# Altium schematic sheet IOS.SchDoc
size A3; DocumentNumber: 3; SheetNumber: 3; SheetTotal: 15
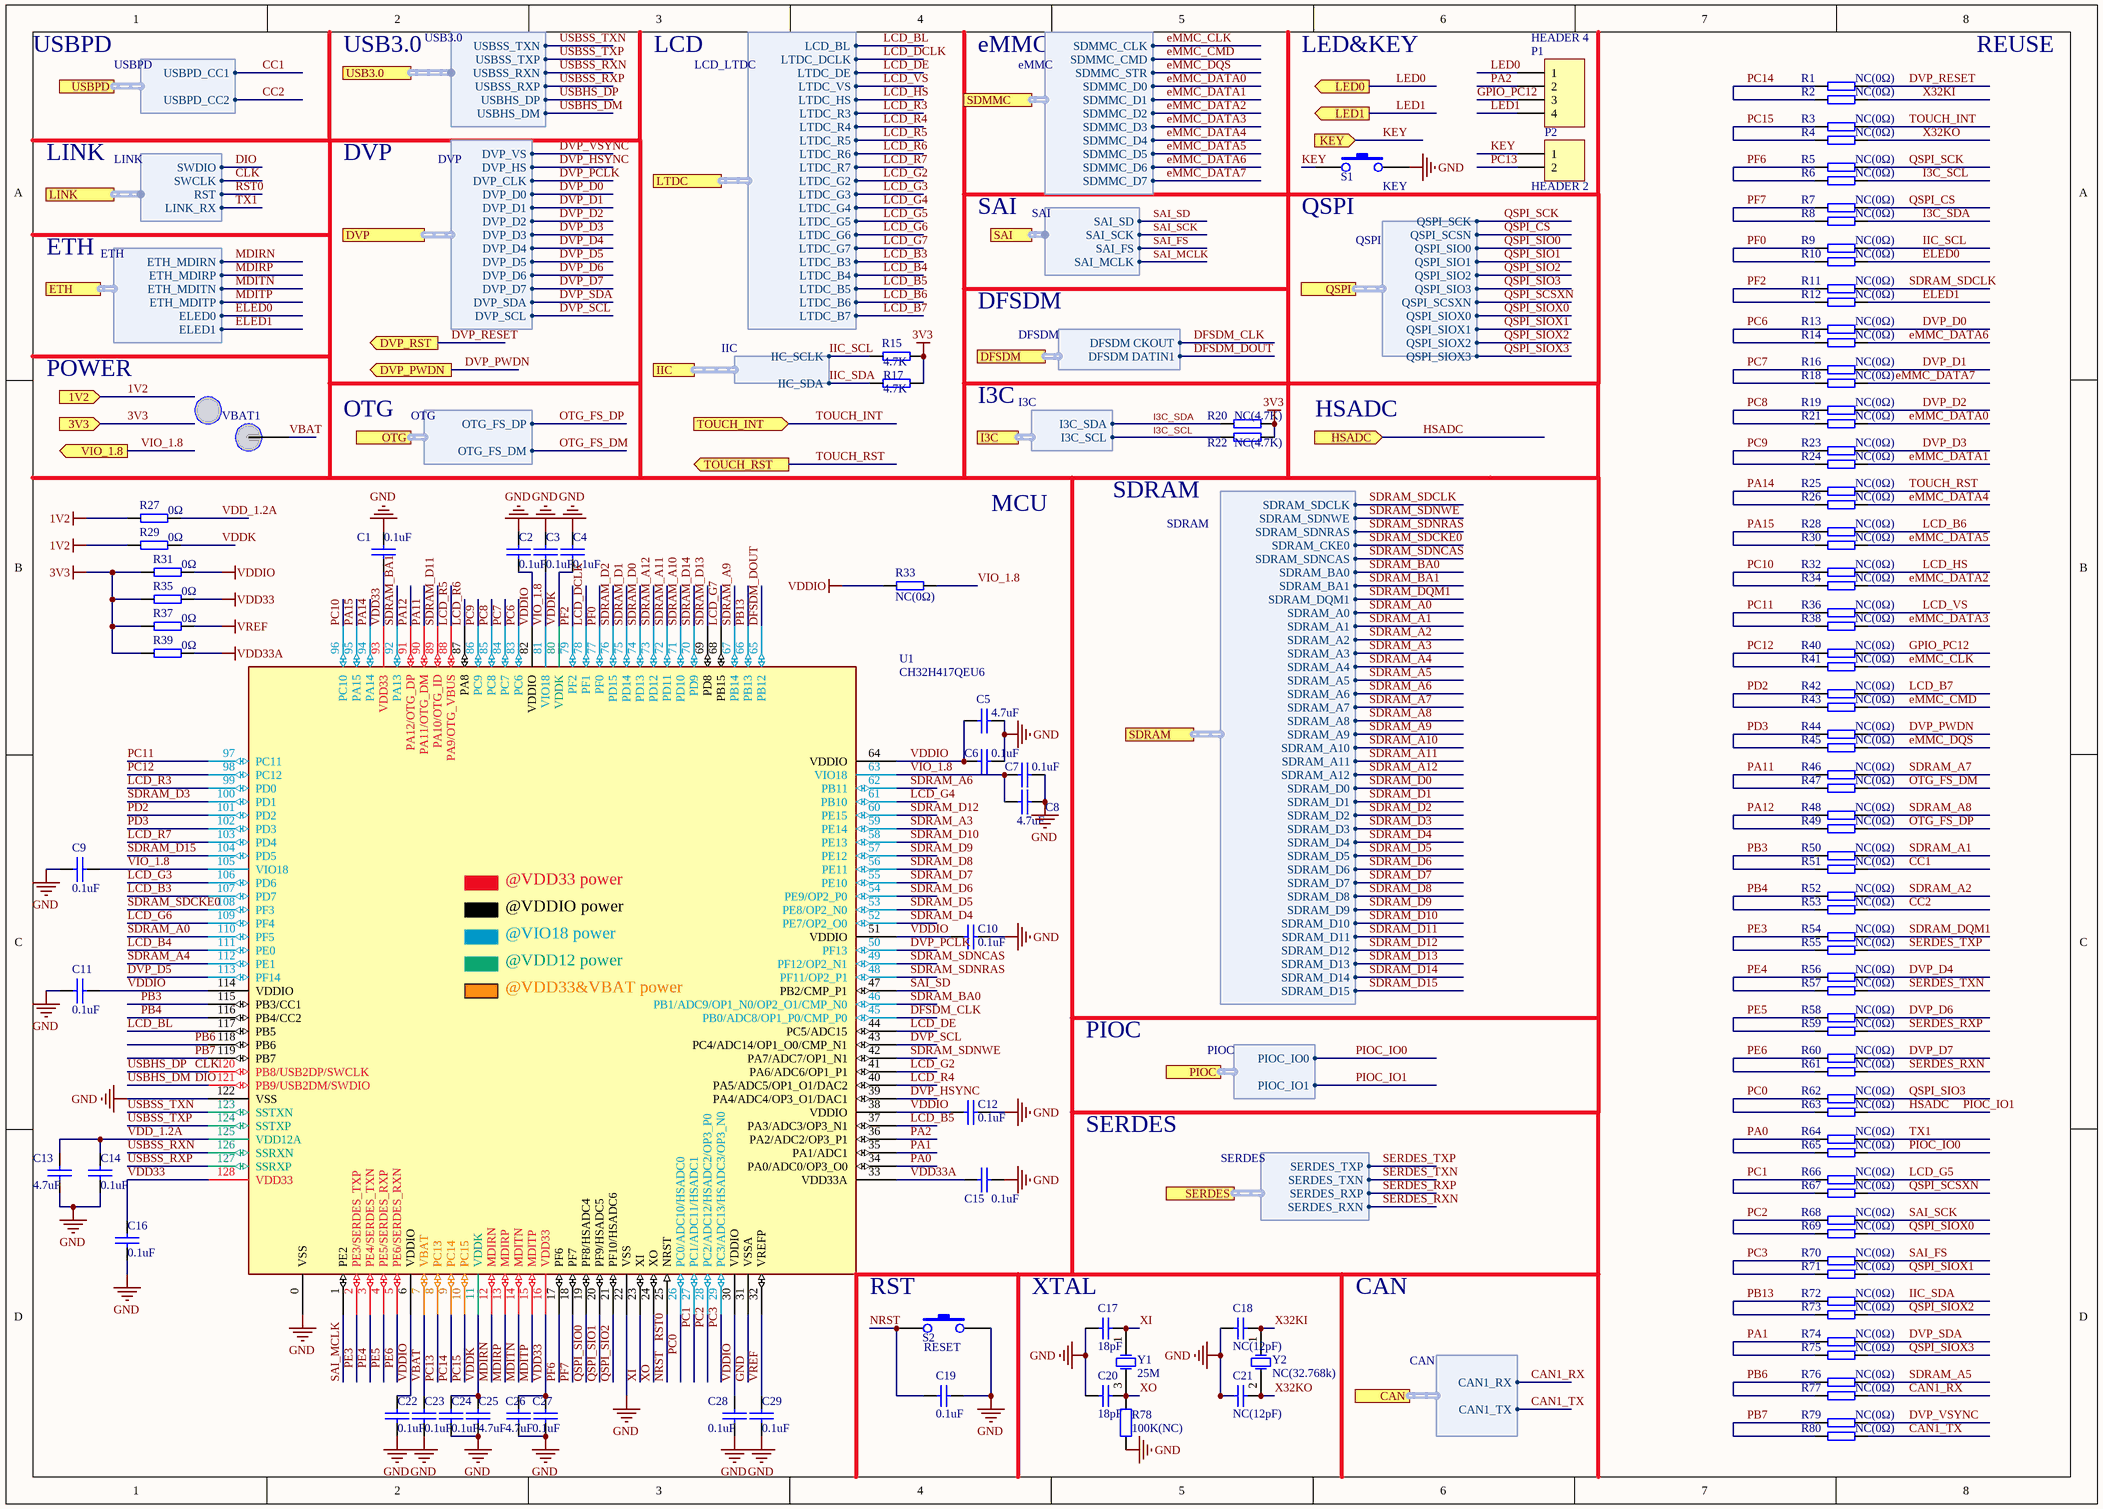
[diagram p0: IOS.SchDoc]

## Parts
C1  0.1uF  [0402_C]
C2  0.1uF  [0402_C]
C3  0.1uF  [0402_C]
C4  0.1uF  [0402_C]
C5  4.7uF  [0402_C]
C6  0.1uF  [0402_C]
C7  0.1uF  [0402_C]
C8  4.7uF  [0402_C]
C9  0.1uF  [0402_C]
C10  0.1uF  [0402_C]
C11  0.1uF  [0402_C]
C12  0.1uF  [0402_C]
C13  4.7uF  [0402_C]
C14  0.1uF  [0402_C]
C15  0.1uF  [0402_C]
C16  0.1uF  [0402_C]
C17  18pF  [0402_C]
C18  NC(12pF)  [0402_C]
C19  0.1uF  [0402_C]
C20  18pF  [0402_C]
C21  NC(12pF)  [0402_C]
C22  0.1uF  [0402_C]
C23  0.1uF  [0402_C]
C24  0.1uF  [0402_C]
C25  4.7uF  [0402_C]
C26  4.7uF  [0402_C]
C27  0.1uF  [0402_C]
C28  0.1uF  [0402_C]
C29  0.1uF  [0402_C]
P1  HEADER 4  [SIP4-2.54mm]
P2  HEADER 2  [SIP2-2.54mm]
R1  NC(0Ω)  [0402]
R2  NC(0Ω)  [0402]
R3  NC(0Ω)  [0402]
R4  NC(0Ω)  [0402]
R5  NC(0Ω)  [0402]
R6  NC(0Ω)  [0402]
R7  NC(0Ω)  [0402]
R8  NC(0Ω)  [0402]
R9  NC(0Ω)  [0402]
R10  NC(0Ω)  [0402]
R11  NC(0Ω)  [0402]
R12  NC(0Ω)  [0402]
R13  NC(0Ω)  [0402]
R14  NC(0Ω)  [0402]
R15  4.7K  [0402]
R16  NC(0Ω)  [0402]
R17  4.7K  [0402]
R18  NC(0Ω)  [0402]
R19  NC(0Ω)  [0402]
R20  NC(4.7K)  [0402]
R21  NC(0Ω)  [0402]
R22  NC(4.7K)  [0402]
R23  NC(0Ω)  [0402]
R24  NC(0Ω)  [0402]
R25  NC(0Ω)  [0402]
R26  NC(0Ω)  [0402]
R27  0Ω  [0402]
R28  NC(0Ω)  [0402]
R29  0Ω  [0402]
R30  NC(0Ω)  [0402]
R31  0Ω  [0402]
R32  NC(0Ω)  [0402]
R33  NC(0Ω)  [0402]
R34  NC(0Ω)  [0402]
R35  0Ω  [0402]
R36  NC(0Ω)  [0402]
R37  0Ω  [0402]
R38  NC(0Ω)  [0402]
R39  0Ω  [0402]
R40  NC(0Ω)  [0402]
R41  NC(0Ω)  [0402]
R42  NC(0Ω)  [0402]
R43  NC(0Ω)  [0402]
R44  NC(0Ω)  [0402]
R45  NC(0Ω)  [0402]
R46  NC(0Ω)  [0402]
R47  NC(0Ω)  [0402]
R48  NC(0Ω)  [0402]
R49  NC(0Ω)  [0402]
R50  NC(0Ω)  [0402]
R51  NC(0Ω)  [0402]
R52  NC(0Ω)  [0402]
R53  NC(0Ω)  [0402]
R54  NC(0Ω)  [0402]
R55  NC(0Ω)  [0402]
R56  NC(0Ω)  [0402]
R57  NC(0Ω)  [0402]
R58  NC(0Ω)  [0402]
R59  NC(0Ω)  [0402]
R60  NC(0Ω)  [0402]
R61  NC(0Ω)  [0402]
R62  NC(0Ω)  [0402]
R63  NC(0Ω)  [0402]
R64  NC(0Ω)  [0402]
R65  NC(0Ω)  [0402]
R66  NC(0Ω)  [0402]
R67  NC(0Ω)  [0402]
R68  NC(0Ω)  [0402]
R69  NC(0Ω)  [0402]
R70  NC(0Ω)  [0402]
R71  NC(0Ω)  [0402]
R72  NC(0Ω)  [0402]
R73  NC(0Ω)  [0402]
R74  NC(0Ω)  [0402]
R75  NC(0Ω)  [0402]
R76  NC(0Ω)  [0402]
R77  NC(0Ω)  [0402]
R78  100K(NC)  [0402]
R79  NC(0Ω)  [0402]
R80  NC(0Ω)  [0402]
S1  KEY  [贴片按键]
S2  RESET  [贴片按键]
U1  CH32H417QEU6  [QFN128_12.3X12.3]
VBAT1  Testpoint  [TESTPOINT2]  (value not drawn)
Y1  25M  [XT3225]
Y2  NC(32.768k)  [FC-135]

## Ports
1V2 (in), 3V3 (in), CAN (harness CAN), DFSDM (harness DFSDM), DVP (harness DVP), DVP_PWDN (out), DVP_RST (out), ETH (harness ETH), HSADC (in), I3C (harness I3C), IIC (harness IIC), KEY (in), LED0 (out), LED1 (out), LINK (harness LINK), LTDC (harness LCD_LTDC), OTG (harness OTG), PIOC (harness PIOC), QSPI (harness QSPI), SAI (harness SAI), SDMMC (harness eMMC), SDRAM (harness SDRAM), SERDES (harness SERDES), TOUCH_INT (in), TOUCH_RST (out), USB3.0 (harness USB3.0), USBPD (harness USBPD), VIO_1.8 (out)

## Harnesses
QSPI: QSPI_SCK, QSPI_SCSN, QSPI_SIO0, QSPI_SIO1, QSPI_SIO2, QSPI_SIO3, QSPI_SCSXN, QSPI_SIOX0, QSPI_SIOX1, QSPI_SIOX2, QSPI_SIOX3
USB3.0: USBHS_DM, USBHS_DP, USBSS_RXP, USBSS_RXN, USBSS_TXP, USBSS_TXN
SDRAM: SDRAM_SDNWE, SDRAM_SDNRAS, SDRAM_CKE0, SDRAM_SDNCAS, SDRAM_BA0, SDRAM_BA1, SDRAM_DQM1, SDRAM_A0, SDRAM_A1, SDRAM_A2, SDRAM_A3, SDRAM_A4, SDRAM_A5, SDRAM_A6, SDRAM_A7, SDRAM_A8, SDRAM_A9, SDRAM_A10, SDRAM_A11, SDRAM_A12, SDRAM_SDCLK, SDRAM_D0, SDRAM_D2, SDRAM_D3, SDRAM_D4, SDRAM_D5, SDRAM_D6, SDRAM_D7, SDRAM_D8, SDRAM_D9, SDRAM_D10, SDRAM_D11, SDRAM_D12, SDRAM_D13, SDRAM_D14, SDRAM_D15, SDRAM_D1
IIC: IIC_SCLK, IIC_SDA
LCD_LTDC: LCD_BL, LTDC_DCLK, LTDC_DE, LTDC_VS, LTDC_HS, LTDC_R3, LTDC_R4, LTDC_R5, LTDC_R6, LTDC_R7, LTDC_G2, LTDC_G3, LTDC_G4, LTDC_G5, LTDC_G6, LTDC_G7, LTDC_B3, LTDC_B4, LTDC_B5, LTDC_B6, LTDC_B7
DVP: DVP_VS, DVP_HS, DVP_CLK, DVP_D0, DVP_D1, DVP_D2, DVP_D3, DVP_D4, DVP_D5, DVP_D6, DVP_D7, DVP_SDA, DVP_SCL
eMMC: SDMMC_CLK, SDMMC_CMD, SDMMC_STR, SDMMC_D1, SDMMC_D0, SDMMC_D2, SDMMC_D3, SDMMC_D4, SDMMC_D5, SDMMC_D6, SDMMC_D7
LINK: SWDIO, SWCLK, RST, LINK_RX
ETH: ETH_MDIRN, ETH_MDIRP, ETH_MDITN, ETH_MDITP, ELED0, ELED1
DFSDM: DFSDM CKOUT, DFSDM DATIN1
SAI: SAI_SD, SAI_SCK, SAI_FS, SAI_MCLK
I3C: I3C_SDA, I3C_SCL
OTG: OTG_FS_DP, OTG_FS_DM
PIOC: PIOC_IO0, PIOC_IO1
SERDES: SERDES_TXP, SERDES_TXN, SERDES_RXP, SERDES_RXN
USBPD: USBPD_CC1, USBPD_CC2
CAN: CAN1_TX, CAN1_RX

## Nets
1V2: R27.2 R29.2 ; port 1V2
3V3: R15.2 R17.1 R20.2 R22.1 R31.2 R35.2 R37.2 R39.2 ; port 3V3
GND: C1.2 C2.2 C3.2 C4.2 C5.1 C6.2 C7.2 C8.1 C9.2 C10.2 C11.1 C12.1 C13.1 C14.1 C15.1 C16.1 C17.1 C18.2 C19.1 C20.1 C21.2 C22.1 C23.1 C24.1 C25.2 C26.1 C27.1 C28.2 C29.1 R78.1 S1.2 S2.2 U1.0(VSS) U1.22(VSS) U1.31(VSSA) U1.122(VSS)
VDD33: C1.1 C16.2 C26.2 C27.2 R35.1 U1.16(VDD33) U1.93(VDD33) U1.128(VDD33)
VDD33A: C15.2 R39.1 U1.33(VDD33A)
VDDIO: C2.1 C5.2 C6.1 C10.1 C11.2 C12.2 C22.2 C28.1 R31.1 R33.2 U1.6(VDDIO) U1.30(VDDIO) U1.38(VDDIO) U1.51(VDDIO) U1.64(VDDIO) U1.82(VDDIO) U1.114(VDDIO)
VREF: C29.2 R37.1 U1.32(VREFP)
CAN1_RX: R77.1 ; port CAN.CAN1_RX
CAN1_TX: R80.1 ; port CAN.CAN1_TX
CC1: R51.1 ; port USBPD.USBPD_CC1
CC2: R53.1 ; port USBPD.USBPD_CC2
CLK: U1.120(PB8/USB2DP/SWCLK) ; port USB3.0.USBHS_DP, port LINK.SWCLK  [also labelled USBHS_DP]
DFSDM_CLK: U1.45(PB0/ADC8/OP1_P0/CMP_P0) ; port DFSDM.DFSDM CKOUT
DFSDM_DOUT: U1.65(PB12) ; port DFSDM.DFSDM DATIN1
DIO: U1.121(PB9/USB2DM/SWDIO) ; port USB3.0.USBHS_DM, port LINK.SWDIO  [also labelled USBHS_DM]
DVP_D0: R13.1 ; port DVP.DVP_D0
DVP_D1: R16.1 ; port DVP.DVP_D1
DVP_D2: R19.1 ; port DVP.DVP_D2
DVP_D3: R23.1 ; port DVP.DVP_D3
DVP_D4: R56.1 ; port DVP.DVP_D4
DVP_D5: U1.113(PF14) ; port DVP.DVP_D5
DVP_D6: R58.1 ; port DVP.DVP_D6
DVP_D7: R60.1 ; port DVP.DVP_D7
DVP_HSYNC: U1.39(PA4/ADC4/OP3_O1/DAC1) ; port DVP.DVP_HS
DVP_PCLK: U1.50(PF13) ; port DVP.DVP_CLK
DVP_PWDN: R44.1 ; port DVP_PWDN
DVP_RESET: R1.1 ; port DVP_RST
DVP_SCL: U1.43(PC4/ADC14/OP1_O0/CMP_N1) ; port DVP.DVP_SCL
DVP_SDA: R74.1 ; port DVP.DVP_SDA
DVP_VSYNC: R79.1 ; port DVP.DVP_VS
ELED0: R10.1 ; port ETH.ELED0
ELED1: R12.1 ; port ETH.ELED1
eMMC_CLK: R41.1 ; port SDMMC.SDMMC_CLK
eMMC_CMD: R43.1 ; port SDMMC.SDMMC_CMD
eMMC_DATA0: R21.1 ; port SDMMC.SDMMC_D0
eMMC_DATA1: R24.1 ; port SDMMC.SDMMC_D1
eMMC_DATA2: R34.1 ; port SDMMC.SDMMC_D2
eMMC_DATA3: R38.1 ; port SDMMC.SDMMC_D3
eMMC_DATA4: R26.1 ; port SDMMC.SDMMC_D4
eMMC_DATA5: R30.1 ; port SDMMC.SDMMC_D5
eMMC_DATA6: R14.1 ; port SDMMC.SDMMC_D6
eMMC_DATA7: R18.1 ; port SDMMC.SDMMC_D7
eMMC_DQS: R45.1 ; port SDMMC.SDMMC_STR
GPIO_PC12: P1.3 R40.1
HSADC: R63.1 ; port HSADC, port PIOC.PIOC_IO1  [also labelled PIOC_IO1]
I3C_SCL: R6.1 R22.2 ; port I3C.I3C_SCL
I3C_SDA: R8.1 R20.1 ; port I3C.I3C_SDA
IIC_SCL: R9.1 R15.1 ; port IIC.IIC_SCLK
IIC_SDA: R17.2 R72.1 ; port IIC.IIC_SDA
KEY: P2.1 S1.1 ; port KEY
LCD_B3: U1.107(PD7) ; port LTDC.LTDC_B3
LCD_B4: U1.111(PE0) ; port LTDC.LTDC_B4
LCD_B5: U1.37(PA3/ADC3/OP3_N1) ; port LTDC.LTDC_B5
LCD_B6: R28.1 ; port LTDC.LTDC_B6
LCD_B7: R42.1 ; port LTDC.LTDC_B7
LCD_BL: U1.117(PB5) ; port LTDC.LCD_BL
LCD_DCLK: U1.78(PF1) ; port LTDC.LTDC_DCLK
LCD_DE: U1.44(PC5/ADC15) ; port LTDC.LTDC_DE
LCD_G2: U1.41(PA6/ADC6/OP1_P1) ; port LTDC.LTDC_G2
LCD_G3: U1.106(PD6) ; port LTDC.LTDC_G3
LCD_G4: U1.61(PB10) ; port LTDC.LTDC_G4
LCD_G5: R66.1 ; port LTDC.LTDC_G5
LCD_G6: U1.109(PF4) ; port LTDC.LTDC_G6
LCD_G7: U1.68(PB15) ; port LTDC.LTDC_G7
LCD_HS: R32.1 ; port LTDC.LTDC_HS
LCD_R3: U1.99(PD0) ; port LTDC.LTDC_R3
LCD_R4: U1.40(PA5/ADC5/OP1_O1/DAC2) ; port LTDC.LTDC_R4
LCD_R5: U1.88(PA9/OTG_VBUS) ; port LTDC.LTDC_R5
LCD_R6: U1.87(PA8) ; port LTDC.LTDC_R6
LCD_R7: U1.103(PD4) ; port LTDC.LTDC_R7
LCD_VS: R36.1 ; port LTDC.LTDC_VS
LED0: P1.1 ; port LED0
LED1: P1.4 ; port LED1
MDIRN: U1.12(MDIRN) ; port ETH.ETH_MDIRN
MDIRP: U1.13(MDIRP) ; port ETH.ETH_MDIRP
MDITN: U1.14(MDITN) ; port ETH.ETH_MDITN
MDITP: U1.15(MDITP) ; port ETH.ETH_MDITP
NRST: C19.2 S2.1 U1.25(NRST) ; port LINK.RST  [also labelled RST0]
OTG_FS_DM: R47.1 ; port OTG.OTG_FS_DM
OTG_FS_DP: R49.1 ; port OTG.OTG_FS_DP
PA0: R64.2 R65.2 U1.34(PA0/ADC0/OP3_O0)
PA1: R74.2 R75.2 U1.35(PA1/ADC1)
PA2: P1.2 U1.36(PA2/ADC2/OP3_P1)
PA11: R46.2 R47.2 U1.90(PA11/OTG_DM)
PA12: R48.2 R49.2 U1.91(PA12/OTG_DP)
PA14: R25.2 R26.2 U1.94(PA14)
PA15: R28.2 R30.2 U1.95(PA15)
PB3: R50.2 R51.2 U1.115(PB3/CC1)
PB4: R52.2 R53.2 U1.116(PB4/CC2)
PB6: R76.2 R77.2 U1.118(PB6)
PB7: R79.2 R80.2 U1.119(PB7)
PB13: R72.2 R73.2 U1.66(PB13)
PC0: R62.2 R63.2 U1.26(PC0/ADC10/HSADC0)
PC1: R66.2 R67.2 U1.27(PC1/ADC11/HSADC1)
PC2: R68.2 R69.2 U1.28(PC2/ADC12/HSADC2/OP3_P0)
PC3: R70.2 R71.2 U1.29(PC3/ADC13/HSADC3/OP3_N0)
PC6: R13.2 R14.2 U1.83(PC6)
PC7: R16.2 R18.2 U1.84(PC7)
PC8: R19.2 R21.2 U1.85(PC8)
PC9: R23.2 R24.2 U1.86(PC9)
PC10: R32.2 R34.2 U1.96(PC10)
PC11: R36.2 R38.2 U1.97(PC11)
PC12: R40.2 R41.2 U1.98(PC12)
PC13: P2.2 U1.8(PC13)
PC14: R1.2 R2.2 U1.9(PC14)
PC15: R3.2 R4.2 U1.10(PC15)
PD2: R42.2 R43.2 U1.101(PD2)
PD3: R44.2 R45.2 U1.102(PD3)
PE3: R54.2 R55.2 U1.2(PE3/SERDES_TXP)
PE4: R56.2 R57.2 U1.3(PE4/SERDES_TXN)
PE5: R58.2 R59.2 U1.4(PE5/SERDES_RXP)
PE6: R60.2 R61.2 U1.5(PE6/SERDES_RXN)
PF0: R9.2 R10.2 U1.77(PF0)
PF2: R11.2 R12.2 U1.79(PF2)
PF6: R5.2 R6.2 U1.17(PF6)
PF7: R7.2 R8.2 U1.18(PF7)
PIOC_IO0: R65.1 ; port PIOC.PIOC_IO0
QSPI_CS: R7.1 ; port QSPI.QSPI_SCSN
QSPI_SCK: R5.1 ; port QSPI.QSPI_SCK
QSPI_SCSXN: R67.1 ; port QSPI.QSPI_SCSXN
QSPI_SIO0: U1.19(PF8/HSADC4) ; port QSPI.QSPI_SIO0
QSPI_SIO1: U1.20(PF9/HSADC5) ; port QSPI.QSPI_SIO1
QSPI_SIO2: U1.21(PF10/HSADC6) ; port QSPI.QSPI_SIO2
QSPI_SIO3: R62.1 ; port QSPI.QSPI_SIO3
QSPI_SIOX0: R69.1 ; port QSPI.QSPI_SIOX0
QSPI_SIOX1: R71.1 ; port QSPI.QSPI_SIOX1
QSPI_SIOX2: R73.1 ; port QSPI.QSPI_SIOX2
QSPI_SIOX3: R75.1 ; port QSPI.QSPI_SIOX3
SAI_FS: R70.1 ; port SAI.SAI_FS
SAI_MCLK: U1.1(PE2) ; port SAI.SAI_MCLK
SAI_SCK: R68.1 ; port SAI.SAI_SCK
SAI_SD: U1.47(PB2/CMP_P1) ; port SAI.SAI_SD
SDRAM_A0: U1.110(PF5) ; port SDRAM.SDRAM_A0
SDRAM_A1: R50.1 ; port SDRAM.SDRAM_A1
SDRAM_A2: R52.1 ; port SDRAM.SDRAM_A2
SDRAM_A3: U1.59(PE14) ; port SDRAM.SDRAM_A3
SDRAM_A4: U1.112(PE1) ; port SDRAM.SDRAM_A4
SDRAM_A5: R76.1 ; port SDRAM.SDRAM_A5
SDRAM_A6: U1.62(PB11) ; port SDRAM.SDRAM_A6
SDRAM_A7: R46.1 ; port SDRAM.SDRAM_A7
SDRAM_A8: R48.1 ; port SDRAM.SDRAM_A8
SDRAM_A9: U1.67(PB14) ; port SDRAM.SDRAM_A9
SDRAM_A10: U1.71(PD10) ; port SDRAM.SDRAM_A10
SDRAM_A11: U1.72(PD11) ; port SDRAM.SDRAM_A11
SDRAM_A12: U1.73(PD12) ; port SDRAM.SDRAM_A12
SDRAM_BA0: U1.46(PB1/ADC9/OP1_N0/OP2_O1/CMP_N0) ; port SDRAM.SDRAM_BA0
SDRAM_BA1: U1.92(PA13) ; port SDRAM.SDRAM_BA1
SDRAM_D0: U1.74(PD13) ; port SDRAM.SDRAM_D0
SDRAM_D1: U1.75(PD14) ; port SDRAM.SDRAM_D1
SDRAM_D2: U1.76(PD15) ; port SDRAM.SDRAM_D2
SDRAM_D3: U1.100(PD1) ; port SDRAM.SDRAM_D3
SDRAM_D4: U1.52(PE7/OP2_O0) ; port SDRAM.SDRAM_D4
SDRAM_D5: U1.53(PE8/OP2_N0) ; port SDRAM.SDRAM_D5
SDRAM_D6: U1.54(PE9/OP2_P0) ; port SDRAM.SDRAM_D6
SDRAM_D7: U1.55(PE10) ; port SDRAM.SDRAM_D7
SDRAM_D8: U1.56(PE11) ; port SDRAM.SDRAM_D8
SDRAM_D9: U1.57(PE12) ; port SDRAM.SDRAM_D9
SDRAM_D10: U1.58(PE13) ; port SDRAM.SDRAM_D10
SDRAM_D11: U1.89(PA10/OTG_ID) ; port SDRAM.SDRAM_D11
SDRAM_D12: U1.60(PE15) ; port SDRAM.SDRAM_D12
SDRAM_D13: U1.69(PD8) ; port SDRAM.SDRAM_D13
SDRAM_D14: U1.70(PD9) ; port SDRAM.SDRAM_D14
SDRAM_D15: U1.104(PD5) ; port SDRAM.SDRAM_D15
SDRAM_DQM1: R54.1 ; port SDRAM.SDRAM_DQM1
SDRAM_SDCKE0: U1.108(PF3) ; port SDRAM.SDRAM_CKE0
SDRAM_SDCLK: R11.1 ; port SDRAM.SDRAM_SDCLK
SDRAM_SDNCAS: U1.49(PF12/OP2_N1) ; port SDRAM.SDRAM_SDNCAS
SDRAM_SDNRAS: U1.48(PF11/OP2_P1) ; port SDRAM.SDRAM_SDNRAS
SDRAM_SDNWE: U1.42(PA7/ADC7/OP1_N1) ; port SDRAM.SDRAM_SDNWE
SERDES_RXN: R61.1 ; port SERDES.SERDES_RXN
SERDES_RXP: R59.1 ; port SERDES.SERDES_RXP
SERDES_TXN: R57.1 ; port SERDES.SERDES_TXN
SERDES_TXP: R55.1 ; port SERDES.SERDES_TXP
TOUCH_INT: R3.1 ; port TOUCH_INT
TOUCH_RST: R25.1 ; port TOUCH_RST
TX1: R64.1 ; port LINK.LINK_RX
USBSS_RXN: U1.126(SSRXN) ; port USB3.0.USBSS_RXN
USBSS_RXP: U1.127(SSRXP) ; port USB3.0.USBSS_RXP
USBSS_TXN: U1.123(SSTXN) ; port USB3.0.USBSS_TXN
USBSS_TXP: U1.124(SSTXP) ; port USB3.0.USBSS_TXP
VBAT: C23.2 U1.7(VBAT) VBAT1.1(point)
VDD_1.2A: C13.2 C14.2 R27.1 U1.125(VDD12A)
VDDK: C4.1 C24.2 C25.1 R29.1 U1.11(VDDK) U1.80(VDDK)
VIO_1.8: C3.1 C7.1 C8.2 C9.1 R33.1 U1.63(VIO18) U1.81(VIO18) U1.105(VIO18) ; port VIO_1.8
X32KI: C18.1 R2.1 Y2.1(OSC1)
X32KO: C21.1 R4.1 Y2.2(OSC2)
XI: C17.2 U1.23(XI) Y1.1(OSC1)
XO: C20.2 R78.2 U1.24(XO) Y1.3(OSC2)

## Notes on the sheet
- USBPD
- USB3.0
- LCD
- eMMC
- LED&KEY
- REUSE
- LINK
- DVP
- SAI
- (near S1) QSPI
- ETH
- DFSDM
- POWER
- OTG
- I3C
- HSADC
- MCU
- SDRAM
- PIOC
- SERDES
- (near U1) RST
- (near C17) XTAL
- CAN
- (in symbol CH32H417QET6) @VDD33 power; @VDDIO power; @VIO18 power; @VDD12 power; @VDD33&VBAT power

## Library data of the parts
C1-C16 C22-C29 = CAP: Capacitor
C17-C21 = Cap: Capacitor
P1 = HEADER 4: Header, 4-Pin
P2 = HEADER 2: Header, 2-Pin
R1-R77 R79 R80 = RES
R78 = Res2: Resistor
S1 S2 = KEY1
U1 = CH32H417QET6: RISC-V FPU HD-MCU, 384MHz, USB3.0 & PD, 100M Ethernet, DVP, SDMMC, QSPI, OPA, ADC, DAC
VBAT1 = Testpoint: 测试点
Y1 Y2 = XTAL: Crystal Oscillator; Published: 8-Jun-2000; LatestRevisionDate: 17-Jul-2002; LatestRevisionNote: Re-released for DXP Platform.; PackageReference: R38; Publisher: Altium Limited